# EasyEDA Pro project examples.epro, schematic Schematic7
Create Date: 2026-03-05; Page Name: P1; Project Name: EdaCopilotExamples; Schematic Name: Schematic7; Update Date: 2026-03-05; Company: EasyEDA.com; Page Size: A4; Version: V1.0
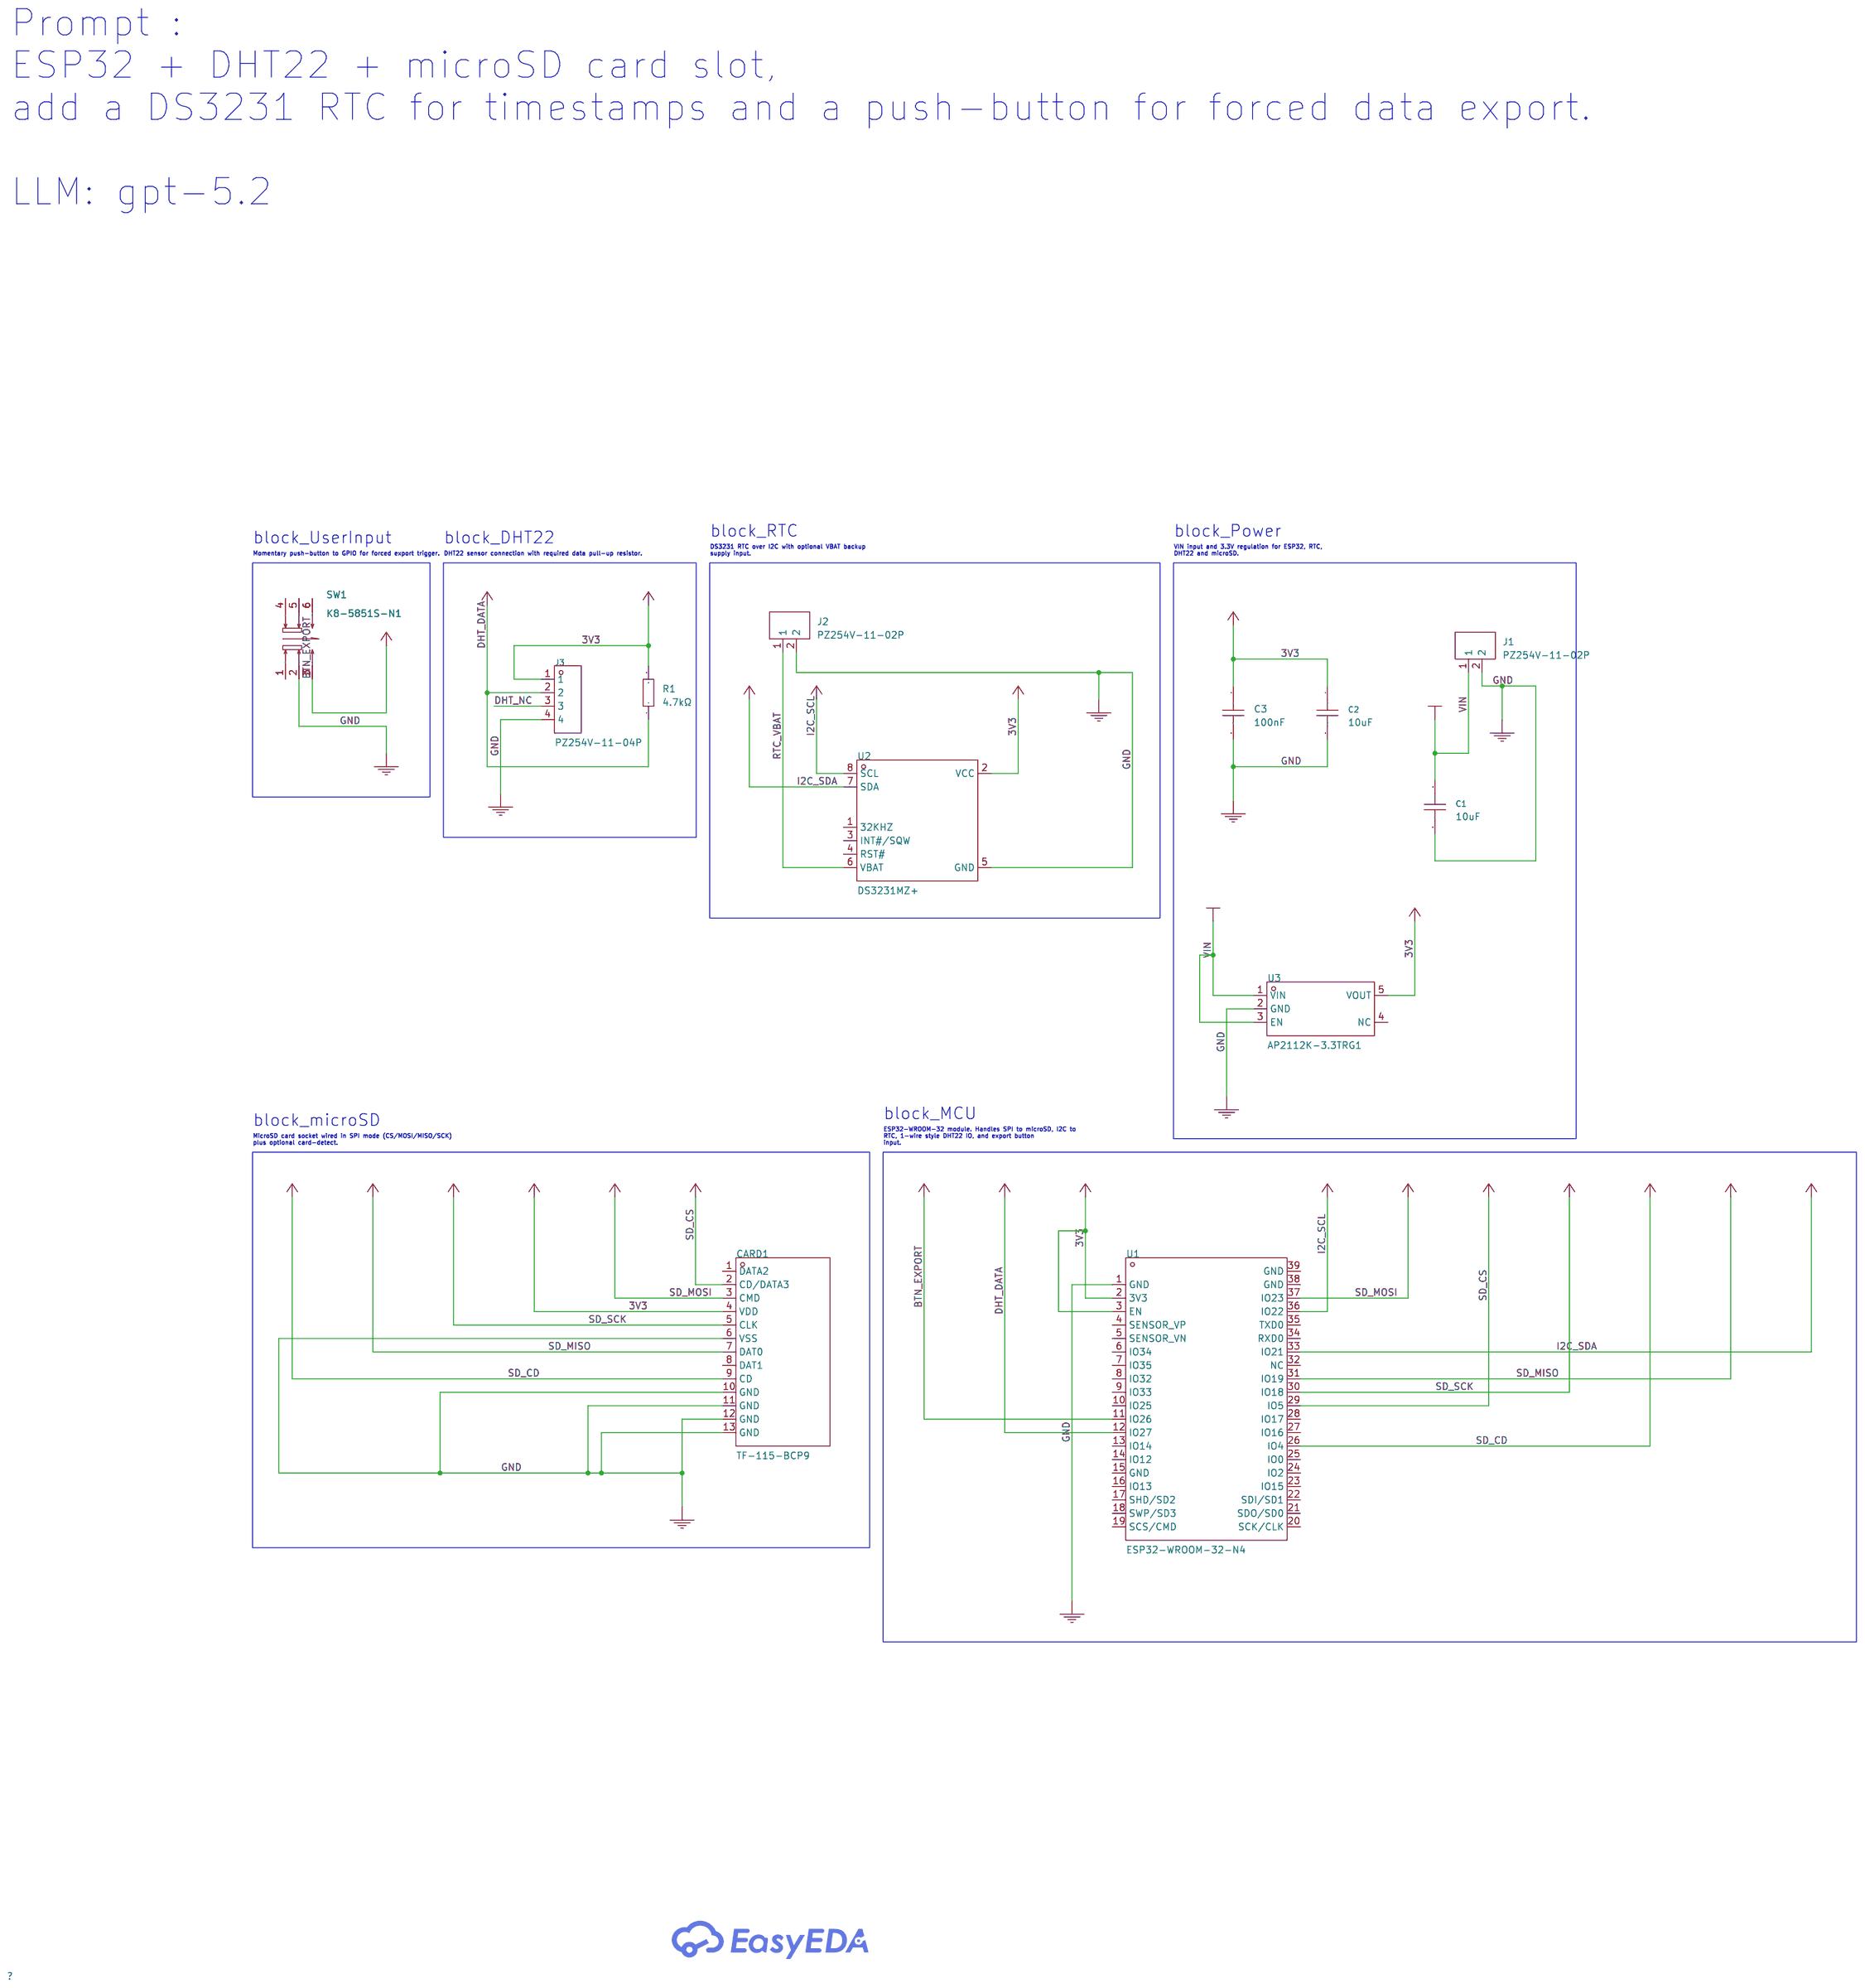
[diagram p6: schematic sheet]

## Parts
C1  10uF  [C0603]
C2  10uF  [C0603]
C3  100nF  [C0402]
CARD1  TF-115-BCP9  [TF-SMD_TF-115-BCP9]
J1  PZ254V-11-02P  [HDR-TH_2P-P2.54-V-M]
J2  PZ254V-11-02P  [HDR-TH_2P-P2.54-V-M]
J3  PZ254V-11-04P  [HDR-TH_4P-P2.54-V-M]
R1  4.7kΩ  [R0603]
SW1  K8-5851S-N1  [SW-SMD_K8-5851S-N1]
U1  ESP32-WROOM-32-N4  [WIFIM-SMD_ESP32-WROOM-32-N4]
U2  DS3231MZ+  [SOIC-8_L4.9-W3.9-P1.27-LS6.0-BL]
U3  AP2112K-3.3TRG1  [SOT-25-5_L2.9-W1.6-P0.95-LS2.8-BL]

## Library data of the parts
C1 C2 = CL10A106MA8NRNC: Capacitance:10uF Tolerance:±20% Tolerance:±20% Voltage Rating:25V Temperature Coefficient:X5R; LCSC Part Name: 10uF ±20% 25V; Supplier Part: C96446; Manufacturer: SAMSUNG(三星); Supplier Footprint: 0603; JLCPCB Part Class: Basic Part; Datasheet: https://item.szlcsc.com/datasheet/CL10A106MA8NRNC/97651.html; Supplier: LCSC; Tolerance: ±20%; Voltage Rating: 25V; Temperature Coefficient: X5R; supplier: LCSC; supplierId: C96446
C3 = CL05B104KB54PNC: Capacitance:100nF Tolerance:±10% Tolerance:±10% Voltage Rating:50V Temperature Coefficient:X7R; LCSC Part Name: 100nF ±10% 50V; Supplier Part: C307331; Manufacturer: SAMSUNG(三星); Supplier Footprint: 0402; JLCPCB Part Class: Basic Part; Datasheet: https://item.szlcsc.com/datasheet/CL05B104KB54PNC/291005.html; Supplier: LCSC; Tolerance: ±10%; Voltage Rating: 50V; Temperature Coefficient: X7R; supplier: LCSC; supplierId: C307331
CARD1 = TF-115-BCP9: Card Connection Mode:Push-Push Card Type:MicroSD Card (TF Card) Connector Type:Connector and Ejector Additional Card Detection Pins:- Supplementary Features:- Height Above Board:1.8mm Operating Temperature:-25℃~+85℃ Operating Temperature:-25℃~+85℃; LCSC Part Name: 自弹式 MicroSD卡(TF卡) 卡座; Supplier Part: C720505; Manufacturer: XUNPU(讯普); Supplier Footprint: SMD; JLCPCB Part Class: Extended Part; Datasheet: https://item.szlcsc.com/datasheet/TF-115-BCP9/763512.html; Supplier: LCSC; Card Connection Mode: Push-Push; Card Type: MicroSD Card (TF Card); Connector Type: Connector and Ejector; Height Above Board: 1.8mm; Operating Temperature: -25℃~+85℃; supplier: LCSC; supplierId: C720505
J1 J2 = PZ254V-11-02P: Pin Structure:1x2P Pitch:2.54mm Row Spacing:- Circluar Pins/Square Pins:Pin Header Mounting Type:Through Hole Number of Rows:1 Number of Pins:2P Current Rating:- Voltage Rating (Max):- Length of Mating Pin:6mm Insulation Height:2.5mm Length of End Connect; LCSC Part Name: 1x2P 间距:2.54mm 方针 直插; Supplier Part: C492401; Manufacturer: XFCN(兴飞); Supplier Footprint: 插件,P=2.54mm; JLCPCB Part Class: Extended Part; Datasheet: https://item.szlcsc.com/datasheet/PZ254V-11-02P/502957.html; Supplier: LCSC; Pin Structure: 1x2P; Pitch: 2.54mm; Circluar Pins/Square Pins: Pin Header; Mounting Type: Through Hole; Number of Rows: 1; Number of Pins: 2P; Length of Mating Pin: 6mm; Insulation Height: 2.5mm; Length of End Connection Pin: 3mm; Contact Material: Brass; Operating Temperature: -40℃~+105℃; Color: Black; supplier: LCSC; supplierId: C492401
J3 = PZ254V-11-04P: Pin Structure:1x4P Pitch:2.54mm Row Spacing:- Circluar Pins/Square Pins:Pin Header Mounting Type:Through Hole Number of Rows:1 Number of Pins:4P Current Rating:3A Voltage Rating (Max):250V Length of Mating Pin:6mm Insulation Height:2.5mm Length of End Con; LCSC Part Name: 1x4P 间距:2.54mm 方针 直插; Supplier Part: C2691448; Manufacturer: XFCN(兴飞); Supplier Footprint: 插件,P=2.54mm; JLCPCB Part Class: Extended Part; Datasheet: https://item.szlcsc.com/datasheet/PZ254V-11-04P/2801085.html; Supplier: LCSC; Pin Structure: 1x4P; Pitch: 2.54mm; Circluar Pins/Square Pins: Pin Header; Mounting Type: Through Hole; Number of Rows: 1; Number of Pins: 4P; Current Rating: 3A; Voltage Rating (Max): 250V; Length of Mating Pin: 6mm; Insulation Height: 2.5mm; Length of End Connection Pin: 3mm; Operating Temperature: -40℃~+105℃; Color: Black; supplier: LCSC; supplierId: C2691448
R1 = 0603WAF4701T5E: Type:Thick Film Resistor Resistance:4.7kΩ Tolerance:±1% Tolerance:±1% Power(Watts):100mW Voltage-Supply(Max):75V Temperature Coefficient:±100ppm/℃ Temperature Coefficient:±100ppm/℃ Operating Temperature:-55℃~+155℃ Operating Temperature:-55℃~+155℃; LCSC Part Name: 4.7kΩ ±1% 100mW 厚膜电阻; Supplier Part: C23162; Manufacturer: UNI-ROYAL(厚声); Supplier Footprint: 0603; JLCPCB Part Class: Basic Part; Datasheet: https://item.szlcsc.com/datasheet/0603WAF4701T5E/23889.html; Supplier: LCSC; Type: Thick Film Resistor; Tolerance: ±1%; Power(Watts): 100mW; Voltage-Supply(Max): 75V; Temperature Coefficient: ±100ppm/℃; Operating Temperature: -55℃~+155℃; supplier: LCSC; supplierId: C23162
SW1 = K8-5851S-N1: Circuit:- Self Lock / No Lock:Non-Latching Actuator Style:Square Plunger IP Rating:- Mounting Type:Surface Mount,Vertical Contact Current:100mA Voltage Rating:30V Actuator/Cap Color:Black With Lamp:Without Termination Style:SMD(SMT) Tab Operating Force:1.; LCSC Part Name: 5.80mmx5.80mm贴片耐高温无锁; Supplier Part: C509414; Manufacturer: 韩国韩荣; Supplier Footprint: SMD; JLCPCB Part Class: Extended Part; Datasheet: https://item.szlcsc.com/datasheet/K8-5851S-N1/523373.html; Supplier: LCSC; Self Lock / No Lock: Non-Latching; Actuator Style: Square Plunger; Mounting Type: Surface Mount,Vertical; Contact Current: 100mA; Voltage Rating: 30V; Actuator/Cap Color: Black; With Lamp: Without; Termination Style: SMD(SMT) Tab; Operating Force: 1.8N; Operating Temperature: -25℃~+80℃; Life: 100,000 Cycles; supplier: LCSC; supplierId: C509414
U1 = ESP32-WROOM-32-N4: Utilized IC / Part:ESP32-DOWDQ6 Wireless Standard:Bluetooth4.2 Interface Type:I2C；GPIO；UART；DAC；SPI；PWM；SDIO；ADC Output Power:20dBm Output Power:20dBm Voltage - Supply:3V~3.6V Voltage - Supply:3V~3.6V Sensitivity:-97dBm Sensitivity:-97dBm Operating Temper; LCSC Part Name: WiFi+蓝牙4.2+双核CPU模块; Supplier Part: C82899; Manufacturer: ESPRESSIF(乐鑫); Supplier Footprint: SMD,25.5x18mm; JLCPCB Part Class: Extended Part; Datasheet: https://item.szlcsc.com/datasheet/ESP32-WROOM-32-N4/84060.html; Supplier: LCSC; Utilized IC / Part: ESP32-DOWDQ6; Wireless Standard: Bluetooth4.2; Interface Type: I2C；GPIO；UART；DAC；SPI；PWM；SDIO；ADC; Output Power: 20dBm; Voltage - Supply: 3V~3.6V; Sensitivity: -97dBm; Operating Temperature: -40℃~+85℃; supplier: LCSC; supplierId: C82899
U2 = DS3231MZ+: Interface:I2C Voltage - Supply:2.3V~5.5V Voltage - Supply:2.3V~5.5V Operating Temperature:-40℃~+85℃ Operating Temperature:-40℃~+85℃; Supplier Part: C722467; Manufacturer: ADI(亚德诺)/MAXIM(美信); Supplier Footprint: SOIC-8; JLCPCB Part Class: Extended Part; Datasheet: https://atta.szlcsc.com/upload/public/pdf/source/20170620/1497944726830.pdf; Supplier: LCSC; Interface: I2C; Voltage - Supply: 2.3V~5.5V; Operating Temperature: -40℃~+85℃; supplier: LCSC; supplierId: C722467
U3 = AP2112K-3.3TRG1: Output Type:Fixed Voltage - Supply:6V Output Voltage:3.3V Output Voltage:3.3V Output Current:600mA Power Supply Rejection Ratio (PSRR):65dB@(1kHz) Voltage Dropout:250mV@(600mA) standby current:55uA Noise:50uVrms Features:Enable；Over Temperature Protection; LCSC Part Name: 输入6V 输出3.3V 600mA; Supplier Part: C51118; Manufacturer: DIODES(美台); Supplier Footprint: SOT-25-5; JLCPCB Part Class: Extended Part; Datasheet: https://item.szlcsc.com/datasheet/AP2112K-3.3TRG1/52131.html; Supplier: LCSC; Output Type: Fixed; Voltage - Supply: 6V; Output Voltage: 3.3V; Output Current: 600mA; Power Supply Rejection Ratio (PSRR): 65dB@(1kHz); Voltage Dropout: 250mV@(600mA); standby current: 55uA; Noise: 50uVrms; Features: Enable；Over Temperature Protection；Over Current Protection; Operating Temperature: -40℃~+85℃@(Ta); Output Configuration: Positive; Number of Outputs: 1; supplier: LCSC; supplierId: C51118

## Nets
3V3: C2.1 C3.1 CARD1.4(VDD) J3.1 R1.2 U1.2(3V3) U1.3(EN) U2.2(VCC) U3.5(VOUT)
GND: C1.2 C2.2 C3.2 CARD1.6(VSS) CARD1.10(GND) CARD1.11(GND) CARD1.12(GND) CARD1.13(GND) J1.2 J2.2 J3.4 SW1.2 U1.1(GND) U2.5(GND) U3.2(GND)
VIN: C1.1 J1.1 U3.1(VIN) U3.3(EN)
BTN_EXPORT: SW1.3 U1.11(IO26)
DHT_DATA: J3.2 R1.1 U1.12(IO27)
DHT_NC: J3.3
I2C_SCL: U1.36(IO22) U2.8(SCL)
I2C_SDA: U1.33(IO21) U2.7(SDA)
RTC_VBAT: J2.1 U2.6(VBAT)
SD_CD: CARD1.9(CD) U1.26(IO4)
SD_CS: CARD1.2(CD/DATA3) U1.29(IO5)
SD_MISO: CARD1.7(DAT0) U1.31(IO19)
SD_MOSI: CARD1.3(CMD) U1.37(IO23)
SD_SCK: CARD1.5(CLK) U1.30(IO18)

Not connected (* = marked no-connect by the designer): CARD1 1(DATA2) 8(DAT1); SW1 1 4 5 6; U1 4(SENSOR_VP) 5(SENSOR_VN) 6(IO34) 7(IO35) 8(IO32) 9(IO33) 10(IO25) 13(IO14) 14(IO12) 15(GND) 16(IO13) 17(SHD/SD2) 18(SWP/SD3) 19(SCS/CMD) 20(SCK/CLK) 21(SDO/SD0) 22(SDI/SD1) 23(IO15) 24(IO2) 25(IO0) 27(IO16) 28(IO17) 32(NC) 34(RXD0) 35(TXD0) 38(GND) 39(GND); U2 1(32KHZ) 3(INT#/SQW) 4(RST#); U3 4(NC)

## Notes on the sheet
- Prompt :
  ESP32 + DHT22 + microSD card slot,
  add a DS3231 RTC for timestamps and a push-button for forced data export.
  LLM: gpt-5.2
- block_UserInput
- block_DHT22
- block_RTC
- block_Power
- Momentary push-button to GPIO for forced export trigger.
- DHT22 sensor connection with required data pull-up resistor.
- DS3231 RTC over I2C with optional VBAT backup
  supply input.
- VIN input and 3.3V regulation for ESP32, RTC,
  DHT22 and microSD.
- block_MCU
- block_microSD
- MicroSD card socket wired in SPI mode (CS/MOSI/MISO/SCK)
  plus optional card-detect.
- ESP32-WROOM-32 module. Handles SPI to microSD, I2C to
  RTC, 1-wire style DHT22 IO, and export button
  input.
